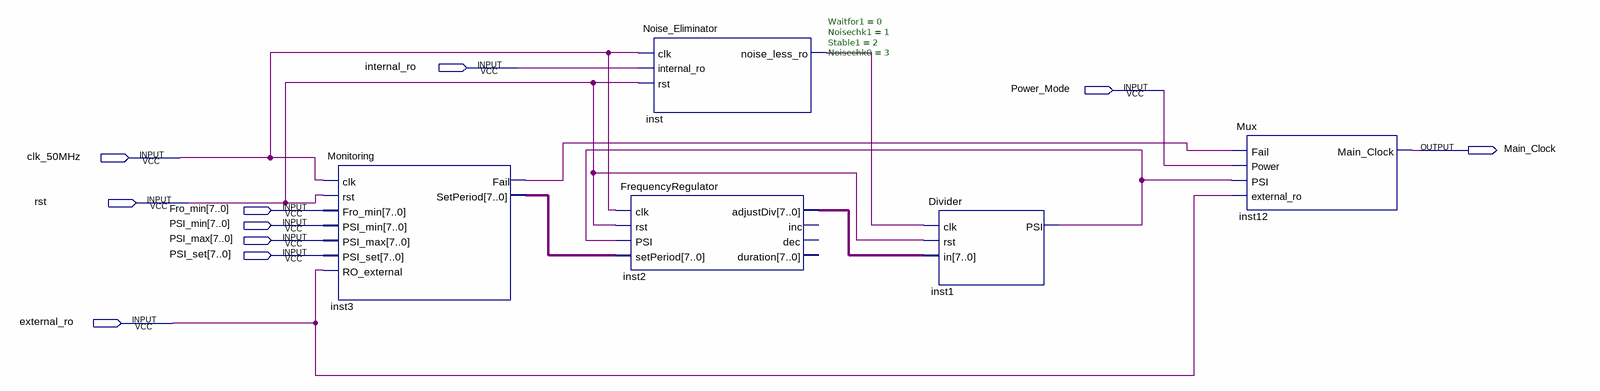
[diagram p0: schematic sheet]
// Quartus schematic FullDesign.bdf as structural Verilog: 5 symbols, 10 pins
module FullDesign (
  input  internal_ro,
  input  Power_Mode,
  input  clk_50MHz,
  input  rst,
  input  [7:0] Fro_min,
  input  [7:0] PSI_min,
  input  [7:0] PSI_max,
  input  [7:0] PSI_set,
  input  external_ro,
  output Main_Clock
);

  wire inst1_psi, inst3_fail, inst_noise_less_ro;
  wire [7:0] inst2_adjustdiv, inst3_setperiod;

  Monitoring inst3 (
    .clk(clk_50MHz), .rst(rst), .Fro_min(Fro_min), .PSI_min(PSI_min), .PSI_max(PSI_max), .PSI_set(PSI_set),
    .RO_external(external_ro), .Fail(inst3_fail), .SetPeriod(inst3_setperiod));
  FrequencyRegulator inst2 (
    .clk(clk_50MHz), .rst(rst), .PSI(inst1_psi), .setPeriod(inst3_setperiod), .adjustDiv(inst2_adjustdiv));  // open: inc, dec, duration
  Noise_Eliminator #(.Waitfor1(0), .Noisechk1(1), .Stable1(2), .Noisechk0(3)) inst (
    .clk(clk_50MHz), .internal_ro(internal_ro), .rst(rst), .noise_less_ro(inst_noise_less_ro));
  Divider inst1 (.clk(inst_noise_less_ro), .rst(rst), .in(inst2_adjustdiv), .PSI(inst1_psi));
  Mux inst12 (
    .Fail(inst3_fail), .Power(Power_Mode), .PSI(inst1_psi), .external_ro(external_ro), .Main_Clock(Main_Clock));
endmodule
